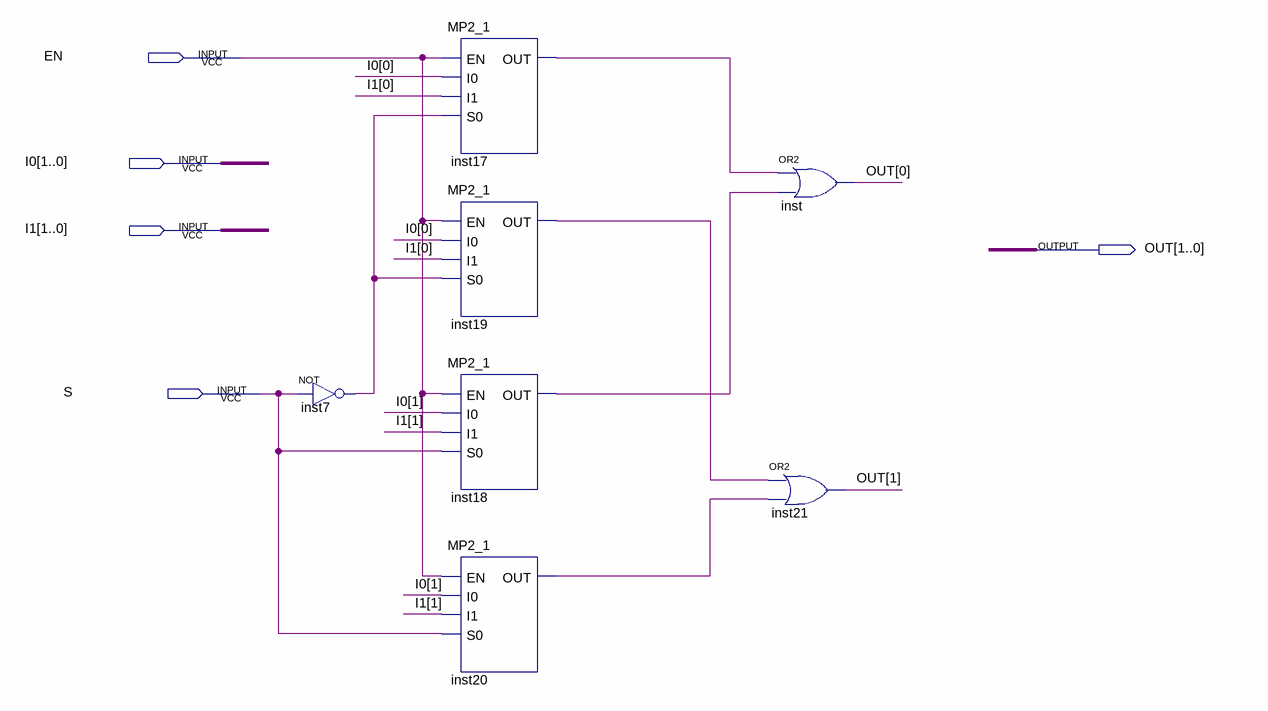
[diagram p0: schematic sheet]
// Quartus schematic MP2_2bdf.bdf as structural Verilog: 7 symbols, 5 pins
module MP2_2bdf (
  input  EN,
  input  [1:0] I0,
  input  [1:0] I1,
  input  S,
  output [1:0] OUT
);

  wire inst7_out, inst17_out, inst18_out, inst19_out, inst20_out;

  not inst7 (inst7_out, S);
  MP2_1 inst17 (.EN(EN), .I0(I0[0]), .I1(I1[0]), .S0(inst7_out), .OUT(inst17_out));
  MP2_1 inst19 (.EN(EN), .I0(I0[0]), .I1(I1[0]), .S0(inst7_out), .OUT(inst19_out));
  MP2_1 inst18 (.EN(EN), .I0(I0[1]), .I1(I1[1]), .S0(S), .OUT(inst18_out));
  MP2_1 inst20 (.EN(EN), .I0(I0[1]), .I1(I1[1]), .S0(S), .OUT(inst20_out));
  or inst (OUT[0], inst17_out, inst18_out);
  or inst21 (OUT[1], inst19_out, inst20_out);
endmodule
